# Altium project STM32_Tutorial.PrjPcb
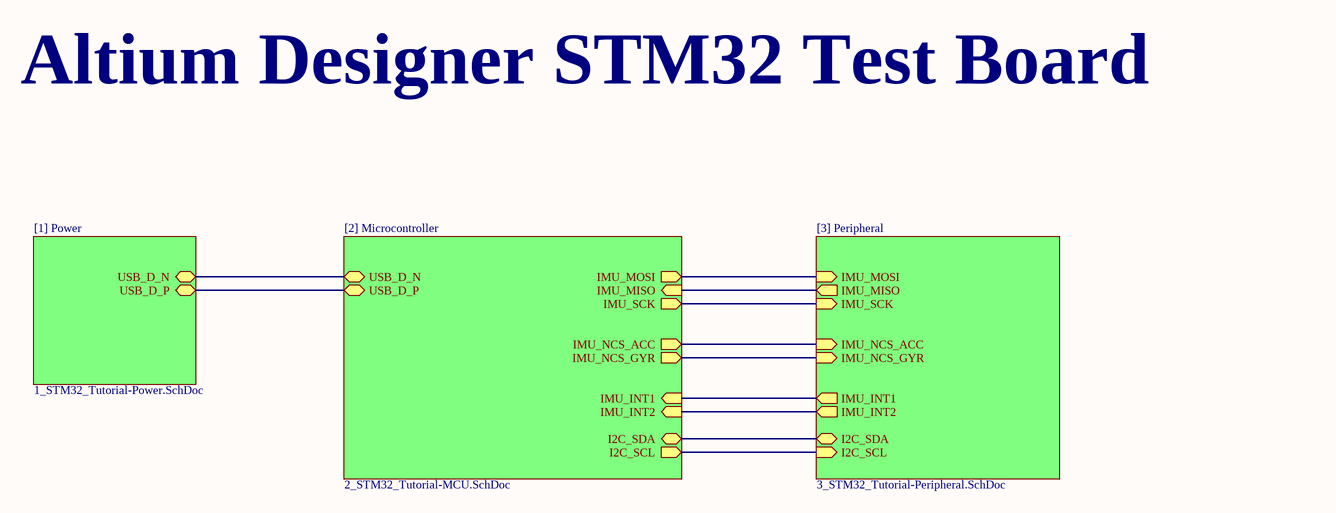
[diagram p0: 0_STM32_Tutorial-Overview.SchDoc]
4 sheets, 30 parts. Net scope: hierarchical (ports join the sheet entries above them; power ports are global).
Board file: STM32-PCB.PcbDoc
Sheets:
  0_STM32_Tutorial-Overview.SchDoc
    [1] Power = 1_STM32_Tutorial-Power.SchDoc
    [2] Microcontroller = 2_STM32_Tutorial-MCU.SchDoc
    [3] Peripheral = 3_STM32_Tutorial-Peripheral.SchDoc

## Sheet 0_STM32_Tutorial-Overview.SchDoc
size A4; SheetNumber: 1; SheetTotal: 4

### Sub-sheets
[1] Power = 1_STM32_Tutorial-Power.SchDoc: USB_D_N (bidir), USB_D_P (bidir)
[2] Microcontroller = 2_STM32_Tutorial-MCU.SchDoc: USB_D_N (bidir), USB_D_P (bidir), IMU_NCS_GYR (out), IMU_NCS_ACC (out), IMU_SCK (out), IMU_MISO (in), IMU_MOSI (out), I2C_SCL (out), I2C_SDA (bidir), IMU_INT1 (in), IMU_INT2 (in)
[3] Peripheral = 3_STM32_Tutorial-Peripheral.SchDoc: IMU_SCK (in), IMU_MOSI (in), IMU_MISO (out), IMU_NCS_GYR (in), IMU_NCS_ACC (in), IMU_INT1 (out), IMU_INT2 (out), I2C_SCL (in), I2C_SDA (bidir)

### Nets
I2C_SCL: sheet [2] Microcontroller/I2C_SCL, sheet [3] Peripheral/I2C_SCL
I2C_SDA: sheet [2] Microcontroller/I2C_SDA, sheet [3] Peripheral/I2C_SDA
IMU_INT1: sheet [2] Microcontroller/IMU_INT1, sheet [3] Peripheral/IMU_INT1
IMU_INT2: sheet [2] Microcontroller/IMU_INT2, sheet [3] Peripheral/IMU_INT2
IMU_MISO: sheet [2] Microcontroller/IMU_MISO, sheet [3] Peripheral/IMU_MISO
IMU_MOSI: sheet [2] Microcontroller/IMU_MOSI, sheet [3] Peripheral/IMU_MOSI
IMU_NCS_ACC: sheet [2] Microcontroller/IMU_NCS_ACC, sheet [3] Peripheral/IMU_NCS_ACC
IMU_NCS_GYR: sheet [2] Microcontroller/IMU_NCS_GYR, sheet [3] Peripheral/IMU_NCS_GYR
IMU_SCK: sheet [2] Microcontroller/IMU_SCK, sheet [3] Peripheral/IMU_SCK
USB_D_N: sheet [1] Power/USB_D_N, sheet [2] Microcontroller/USB_D_N
USB_D_P: sheet [1] Power/USB_D_P, sheet [2] Microcontroller/USB_D_P

### Notes on the sheet
- Altium Designer STM32 Test Board

## Sheet 1_STM32_Tutorial-Power.SchDoc: Power
size A4; SheetNumber: 2; SheetTotal: 4
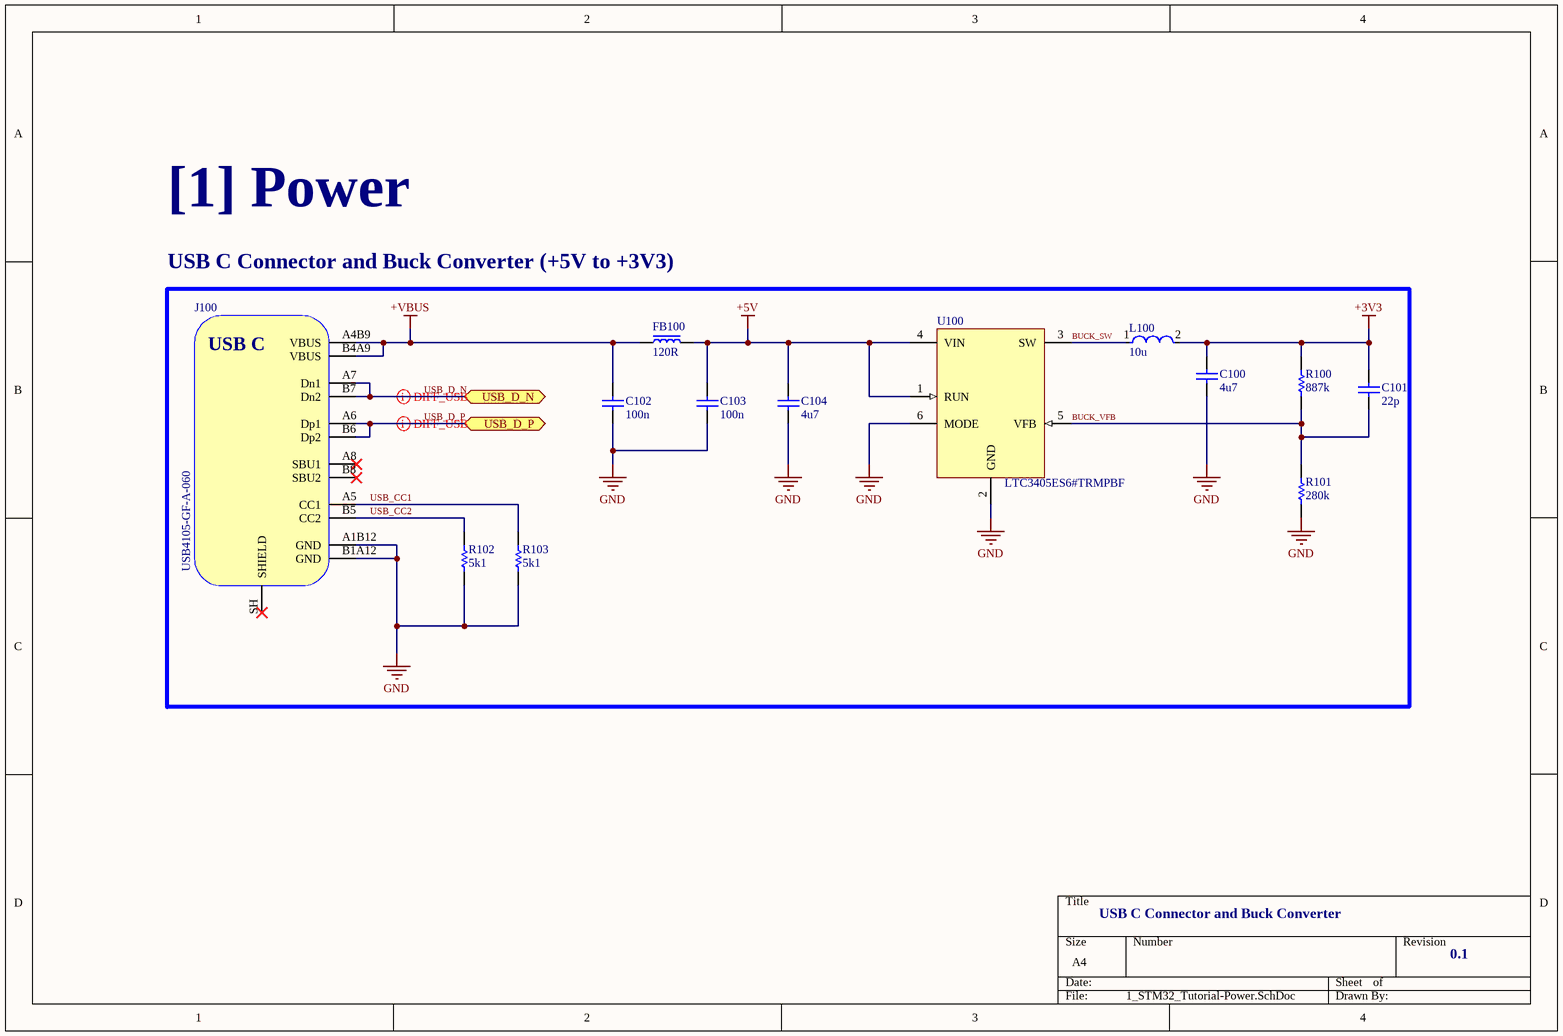
[diagram p1: 1_STM32_Tutorial-Power.SchDoc]

### Parts
C100  4u7  [CAP_0805]
C101  22p  [CAP_0603]
C102  100n  [CAP_0603]
C103  100n  [CAP_0603]
C104  4u7  [CAP_0805]
FB100  120R  [KMZ1608DHR121CTDH5]
J100  USB4105-GF-A-060  [USB4105-GF-A-060]
L100  10u  [FP-NRH2412-MFG]
R100  887k  [RES_0603]
R101  280k  [RES_0603]
R102  5k1  [RES_0603]
R103  5k1  [RES_0603]
U100  LTC3405ES6#TRMPBF  [SOT-23-6]

### Blocks framed on the sheet
USB C Connector and Buck Converter (+5V to +3V3): C100-C104 FB100 J100 L100 R100-R103 U100

### Ports
USB_D_N (bidir, see 0_STM32_Tutorial-Overview[2B], 2_STM32_Tutorial-MCU[2B]), USB_D_P (bidir, see 0_STM32_Tutorial-Overview[2B], 2_STM32_Tutorial-MCU[2B])

### Nets
+3V3: C100.1 C101.2 L100.2 R100.2
+5V: C103.2 C104.1 FB100.2 U100.1(RUN) U100.4(VIN)
+VBUS: C102.2 FB100.1 J100.A4B9(VBUS) J100.B4A9(VBUS)
GND: C100.2 C102.1 C103.1 C104.2 J100.A1B12(GND) J100.B1A12(GND) R101.1 R102.1 R103.1 U100.2(GND) U100.6(MODE)
BUCK_SW: L100.1 U100.3(SW)
BUCK_VFB: C101.1 R100.1 R101.2 U100.5(VFB)
USB_CC1: J100.A5(CC1) R103.2
USB_CC2: J100.B5(CC2) R102.2
USB_D_N: J100.A7(Dn1) J100.B7(Dn2) ; port USB_D_N
USB_D_P: J100.A6(Dp1) J100.B6(Dp2) ; port USB_D_P

Not connected (* = marked no-connect by the designer): J100 A8(SBU1)* B8(SBU2)* SH(SHIELD)*

### Layout directives
differential pair; differential pair class USB: USB_D_N, USB_D_P

### Notes on the sheet
- [1] Power
- USB C Connector and Buck Converter
- 0.1
- (in symbol USB4105-GF-A-060) USB C

### Library data of the parts
C100 C104 = CAP_0805: Capacitor SMD 0805 Generic; Manufacturer: *; Manufacturer Part Number: *; Tolerance: *; Package Size: *; LCSC Part Number: *
C101-C103 = CAP_0603: Capacitor SMD 0603 Generic; Manufacturer: *; Manufacturer Part Number: *; Tolerance: *; Package Size: *; LCSC Part Number: *
FB100 = KMZ1608DHR121CTDH5: Ferrite Beads 120MHz 0.3Ohm 25% 1608 AEC-Q200; Manufacturer: *; Manufacturer Part Number: *; LCSC Part Number: *
J100 = USB4105-GF-A-060: USB Connector Type C SMT 12 Pin; Manufacturer: *; Manufacturer Part Number: *; LCSC Part Number: *
L100 = CMP-14484-000582-1: NRH2412T100MNGH - Shielded Wirewound Inductor 10uH 20% 0.51A 0.72Ω SMD; DC Resistance (DCR): 600mR; Current Rating: 450mA; Saturation Current: 810mA; Core Material: Ferrite; Test Frequency: 100kHz; Self Resonant Frequency: 29MHz; Termination: SMD/SMT; Shielding: Shielded; Height - Seated (Max): 0.047inch; Case/Package: Nonstandard; Tolerance: 20%; Height: 1.2mm; Package Quantity: 2500; Mount: Surface Mount; Min Operating Temperature: -25°C; Inductance: 10uH; Width: 0.095inch; Length: 0.095inch; RoHS Compliant: Yes; Max DC Current: 810mA; Packaging: Tape and Reel; Max Operating Temperature: 120°C; Halogen Free: Halogen Free
R100-R103 = RES_0603: Resistor SMD 0603 Generic; Manufacturer: *; Manufacturer Part Number: *; Tolerance: *; Package Size: *; LCSC Part Number: *
U100 = LTC3405ES6#TRMPBF: 1.5MHz, 300mA Synchronous Step-Down Regulator in ThinSOT; Manufacturer: Analog Devices; Manufacturer Part Number: LTC3405ES6#TRMPBF

## Sheet 2_STM32_Tutorial-MCU.SchDoc
size A4; SheetNumber: 3; SheetTotal: 4
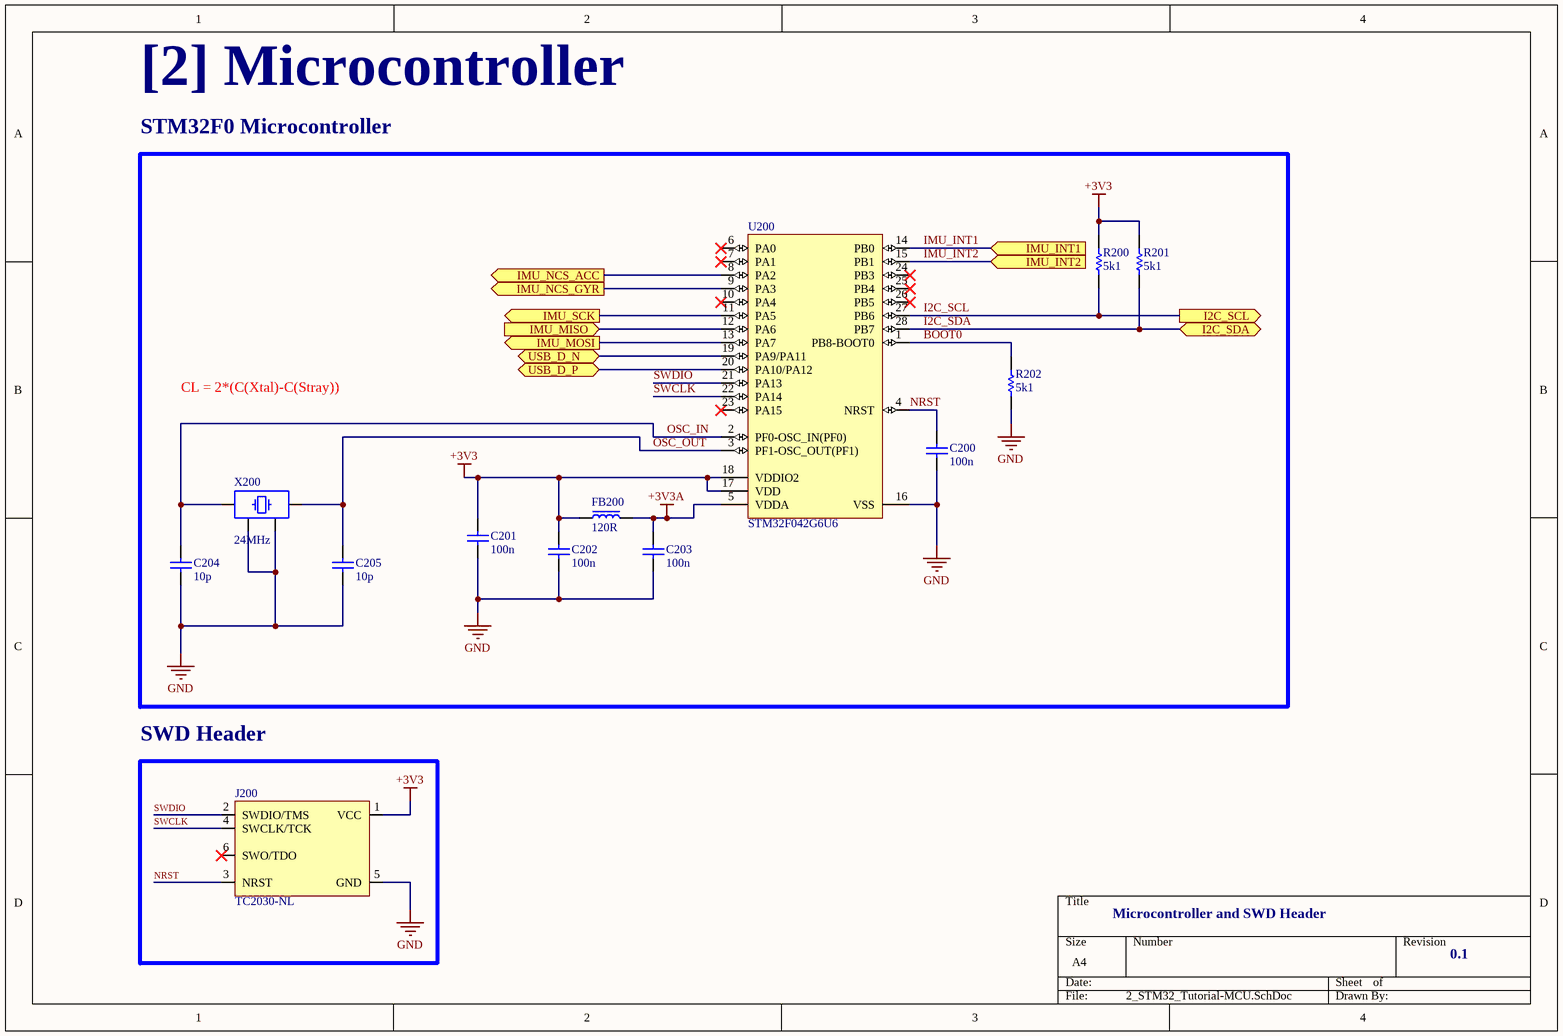
[diagram p2: 2_STM32_Tutorial-MCU.SchDoc]

### Parts
C200  100n  [CAP_0603]
C201  100n  [CAP_0603]
C202  100n  [CAP_0603]
C203  100n  [CAP_0603]
C204  10p  [CAP_0603]
C205  10p  [CAP_0603]
FB200  120R  [KMZ1608DHR121CTDH5]
J200  TC2030-NL  [TC2030-NL-FP]
R200  5k1  [RES_0603]
R201  5k1  [RES_0603]
R202  5k1  [RES_0603]
U200  STM32F042G6U6  [STM-UFQFPN28_V]
X200  24MHz  [TSX-3225_24.0000MF15X-AC]

### Blocks framed on the sheet
STM32F0 Microcontroller: C200-C205 FB200 R200-R202 U200 X200
SWD Header: J200

### Ports
I2C_SCL (out, see 0_STM32_Tutorial-Overview[3C], 3_STM32_Tutorial-Peripheral[3B]), I2C_SDA (bidir, see 0_STM32_Tutorial-Overview[3B], 3_STM32_Tutorial-Peripheral[3C]), IMU_INT1 (in, see 0_STM32_Tutorial-Overview[3B], 3_STM32_Tutorial-Peripheral[3B]), IMU_INT2 (in, see 0_STM32_Tutorial-Overview[3B], 3_STM32_Tutorial-Peripheral[3C]), IMU_MISO (in, see 0_STM32_Tutorial-Overview[3B], 3_STM32_Tutorial-Peripheral[1C]), IMU_MOSI (out, see 0_STM32_Tutorial-Overview[3B], 3_STM32_Tutorial-Peripheral[1B]), IMU_NCS_ACC (out, see 0_STM32_Tutorial-Overview[3B], 3_STM32_Tutorial-Peripheral[1C]), IMU_NCS_GYR (out, see 0_STM32_Tutorial-Overview[3B], 3_STM32_Tutorial-Peripheral[1C]), IMU_SCK (out, see 0_STM32_Tutorial-Overview[3B], 3_STM32_Tutorial-Peripheral[1B]), USB_D_N (bidir, see 0_STM32_Tutorial-Overview[2B], 1_STM32_Tutorial-Power[2B]), USB_D_P (bidir, see 0_STM32_Tutorial-Overview[2B], 1_STM32_Tutorial-Power[2B])

### Nets
+3V3: C201.2 C202.2 FB200.1 J200.1(VCC) R200.2 R201.2 U200.17(VDD) U200.18(VDDIO2)
+3V3A: C203.2 FB200.2 U200.5(VDDA)
GND: C200.1 C201.1 C202.1 C203.1 C204.1 C205.1 J200.5(GND) R202.1 U200.16(VSS) X200.2 X200.4
BOOT0: R202.2 U200.1(PB8-BOOT0)
I2C_SCL: R200.1 U200.27(PB6) ; port I2C_SCL
I2C_SDA: R201.1 U200.28(PB7) ; port I2C_SDA
IMU_INT1: U200.14(PB0) ; port IMU_INT1
IMU_INT2: U200.15(PB1) ; port IMU_INT2
IMU_MISO: U200.12(PA6) ; port IMU_MISO
IMU_MOSI: U200.13(PA7) ; port IMU_MOSI
IMU_NCS_ACC: U200.8(PA2) ; port IMU_NCS_ACC
IMU_NCS_GYR: U200.9(PA3) ; port IMU_NCS_GYR
IMU_SCK: U200.11(PA5) ; port IMU_SCK
NRST: C200.2 J200.3(NRST) U200.4(NRST)
OSC_IN: C204.2 U200.2(PF0-OSC_IN(PF0)) X200.1
OSC_OUT: C205.2 U200.3(PF1-OSC_OUT(PF1)) X200.3
SWCLK: J200.4(SWCLK/TCK) U200.22(PA14)
SWDIO: J200.2(SWDIO/TMS) U200.21(PA13)
USB_D_N: U200.19(PA9/PA11) ; port USB_D_N
USB_D_P: U200.20(PA10/PA12) ; port USB_D_P

Not connected (* = marked no-connect by the designer): J200 6(SWO/TDO)*; U200 6(PA0)* 7(PA1)* 10(PA4)* 23(PA15)* 24(PB3)* 25(PB4)* 26(PB5)*

### Notes on the sheet
- [2] Microcontroller
- CL = 2*(C(Xtal)-C(Stray))
- Microcontroller and SWD Header
- 0.1

### Library data of the parts
C200-C205 = CAP_0603: Capacitor SMD 0603 Generic; Manufacturer: *; Manufacturer Part Number: *; Tolerance: *; Package Size: *; LCSC Part Number: *
FB200 = KMZ1608DHR121CTDH5: as FB100 on sheet 1_STM32_Tutorial-Power; Manufacturer: *; Manufacturer Part Number: *; LCSC Part Number: *
J200 = TC2030-NL: Tag-Connect No-Solder SWD Debug Connector (No Legs) DO NOT PLACE; Manufacturer: Tag-Connect; Manufacturer Part Number: TC2030-NL-FP; LCSC: *
R200-R202 = RES_0603: Resistor SMD 0603 Generic; Manufacturer: *; Manufacturer Part Number: *; Tolerance: *; Package Size: *; LCSC Part Number: *
U200 = CMP-0304-00112-2: ARM Cortex-M0 32-bit MCU, 32 KB Flash, 6 KB Internal RAM, 24 I/Os, 28-Pin UFQFPN, -40 to 85 degC, Tray; Manufacturer: STMicroelectronics; FLASH Size (Prog) (kB): 32; I/Os (High Current): 24; Internal RAM Size (kB): 6; Supply Voltage(Vcc) min (V): 2; Operating Frequency(F) (Processor speed) (MHz): 48; Core: ARM Cortex-M0; PartNumber: STM32F042G6U6; Packing: Tray; Package Description: 28-Pin Ultra Thin Fine Pitch Quad Flat No-Lead, 4 x 4 x 0.6 mm Body, 0.5 mm Pitch; ComponentLink2Description: Datasheet; ComponentLink1Description: Manufacturer URL; Package Reference: UFQFPN28; DatasheetVersion: Rev. 5; ComponentLink1URL: http://www.st.com/; ComponentLink2URL: http://www.st.com/st-web-ui/static/active/en/resource/technical/document/datasheet/DM00105814.pdf; Mounting Technology: Surface Mount
X200 = TSX-3225_24.0000MF15X-AC: Crystal SMD 24MHz 10PPM 7pF 3225; Manufacturer: Epson; Manufacturer Part Number: TSX-3225_24.0000MF15X-AC; LCSC: *

## Sheet 3_STM32_Tutorial-Peripheral.SchDoc
size A4; SheetNumber: 4; SheetTotal: 4
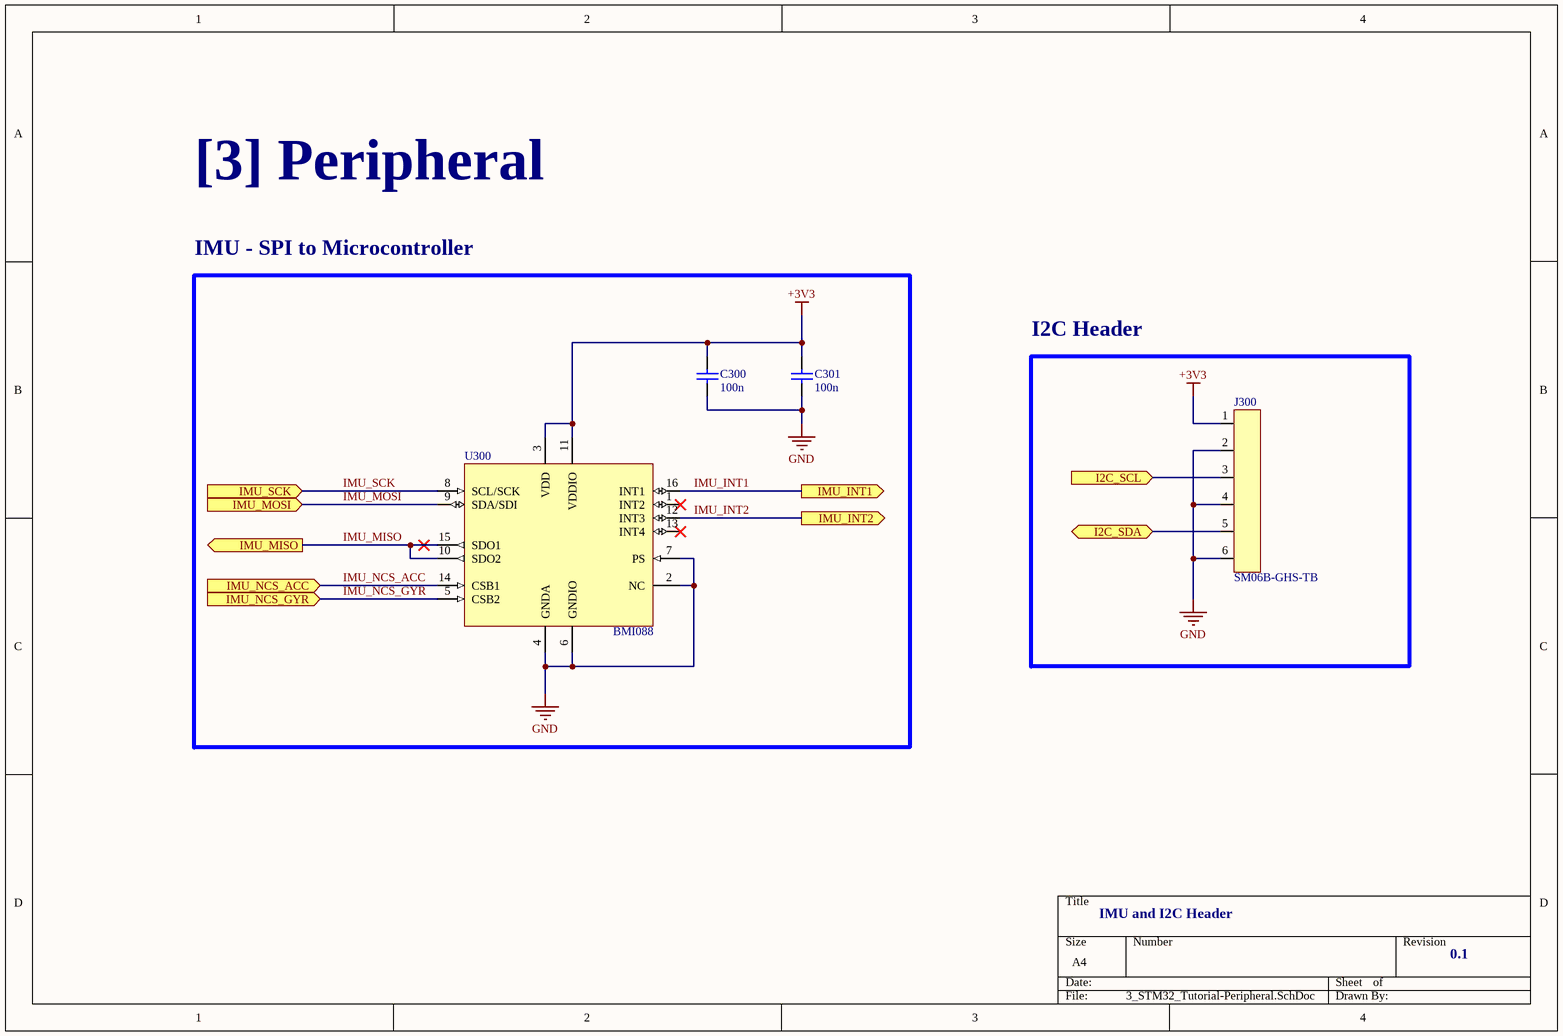
[diagram p3: 3_STM32_Tutorial-Peripheral.SchDoc]

### Parts
C300  100n  [CAP_0603]
C301  100n  [CAP_0603]
J300  SM06B-GHS-TB  [SM06B-GHS-TB]
U300  BMI088  [BMI088]

### Blocks framed on the sheet
IMU - SPI to Microcontroller: C300 C301 U300
I2C Header: J300

### Ports
I2C_SCL (in, see 0_STM32_Tutorial-Overview[3C], 2_STM32_Tutorial-MCU[4B]), I2C_SDA (bidir, see 0_STM32_Tutorial-Overview[3B], 2_STM32_Tutorial-MCU[4B]), IMU_INT1 (out, see 0_STM32_Tutorial-Overview[3B], 2_STM32_Tutorial-MCU[3A]), IMU_INT2 (out, see 0_STM32_Tutorial-Overview[3B], 2_STM32_Tutorial-MCU[3B]), IMU_MISO (out, see 0_STM32_Tutorial-Overview[3B], 2_STM32_Tutorial-MCU[2B]), IMU_MOSI (in, see 0_STM32_Tutorial-Overview[3B], 2_STM32_Tutorial-MCU[2B]), IMU_NCS_ACC (in, see 0_STM32_Tutorial-Overview[3B], 2_STM32_Tutorial-MCU[2B]), IMU_NCS_GYR (in, see 0_STM32_Tutorial-Overview[3B], 2_STM32_Tutorial-MCU[2B]), IMU_SCK (in, see 0_STM32_Tutorial-Overview[3B], 2_STM32_Tutorial-MCU[2B])

### Nets
+3V3: C300.2 C301.2 J300.1 U300.3(VDD) U300.11(VDDIO)
GND: C300.1 C301.1 J300.2 J300.4 J300.6 U300.2(NC) U300.4(GNDA) U300.6(GNDIO) U300.7(PS)
I2C_SCL: J300.3 ; port I2C_SCL
I2C_SDA: J300.5 ; port I2C_SDA
IMU_INT1: U300.16(INT1) ; port IMU_INT1
IMU_INT2: U300.12(INT3) ; port IMU_INT2
IMU_MISO: U300.10(SDO2) U300.15(SDO1) ; port IMU_MISO
IMU_MOSI: U300.9(SDA/SDI) ; port IMU_MOSI
IMU_NCS_ACC: U300.14(CSB1) ; port IMU_NCS_ACC
IMU_NCS_GYR: U300.5(CSB2) ; port IMU_NCS_GYR
IMU_SCK: U300.8(SCL/SCK) ; port IMU_SCK

Not connected (* = marked no-connect by the designer): U300 1(INT2)* 13(INT4)*

### Notes on the sheet
- [3] Peripheral
- IMU and I2C Header
- 0.1

### Library data of the parts
C300 C301 = CAP_0603: Capacitor SMD 0603 Generic; Manufacturer: *; Manufacturer Part Number: *; Tolerance: *; Package Size: *; LCSC Part Number: *
J300 = SM06B-GHS-TB: Header Connector 6 Position 1.25MM Pitch SMD Horizontal JST GH
U300 = BMI088: Inertial Measurement Unit IMU 6-Axis LGA; Manufacturer: Bosch; MAnufacturer Part Number: BMI088; LCSC: *

## Nets that join several sheets
+3V3: 1_STM32_Tutorial-Power (C100.1 C101.2 L100.2 R100.2), 2_STM32_Tutorial-MCU (8 pins), 3_STM32_Tutorial-Peripheral (5 pins)
GND: 1_STM32_Tutorial-Power (11 pins), 2_STM32_Tutorial-MCU (11 pins), 3_STM32_Tutorial-Peripheral (9 pins)
I2C_SCL: 2_STM32_Tutorial-MCU (R200.1 U200.27), 3_STM32_Tutorial-Peripheral (J300.3)
I2C_SDA: 2_STM32_Tutorial-MCU (R201.1 U200.28), 3_STM32_Tutorial-Peripheral (J300.5)
IMU_INT1: 2_STM32_Tutorial-MCU (U200.14), 3_STM32_Tutorial-Peripheral (U300.16)
IMU_INT2: 2_STM32_Tutorial-MCU (U200.15), 3_STM32_Tutorial-Peripheral (U300.12)
IMU_MISO: 2_STM32_Tutorial-MCU (U200.12), 3_STM32_Tutorial-Peripheral (U300.10 U300.15)
IMU_MOSI: 2_STM32_Tutorial-MCU (U200.13), 3_STM32_Tutorial-Peripheral (U300.9)
IMU_NCS_ACC: 2_STM32_Tutorial-MCU (U200.8), 3_STM32_Tutorial-Peripheral (U300.14)
IMU_NCS_GYR: 2_STM32_Tutorial-MCU (U200.9), 3_STM32_Tutorial-Peripheral (U300.5)
IMU_SCK: 2_STM32_Tutorial-MCU (U200.11), 3_STM32_Tutorial-Peripheral (U300.8)
USB_D_N: 1_STM32_Tutorial-Power (J100.A7 J100.B7), 2_STM32_Tutorial-MCU (U200.19)
USB_D_P: 1_STM32_Tutorial-Power (J100.A6 J100.B6), 2_STM32_Tutorial-MCU (U200.20)